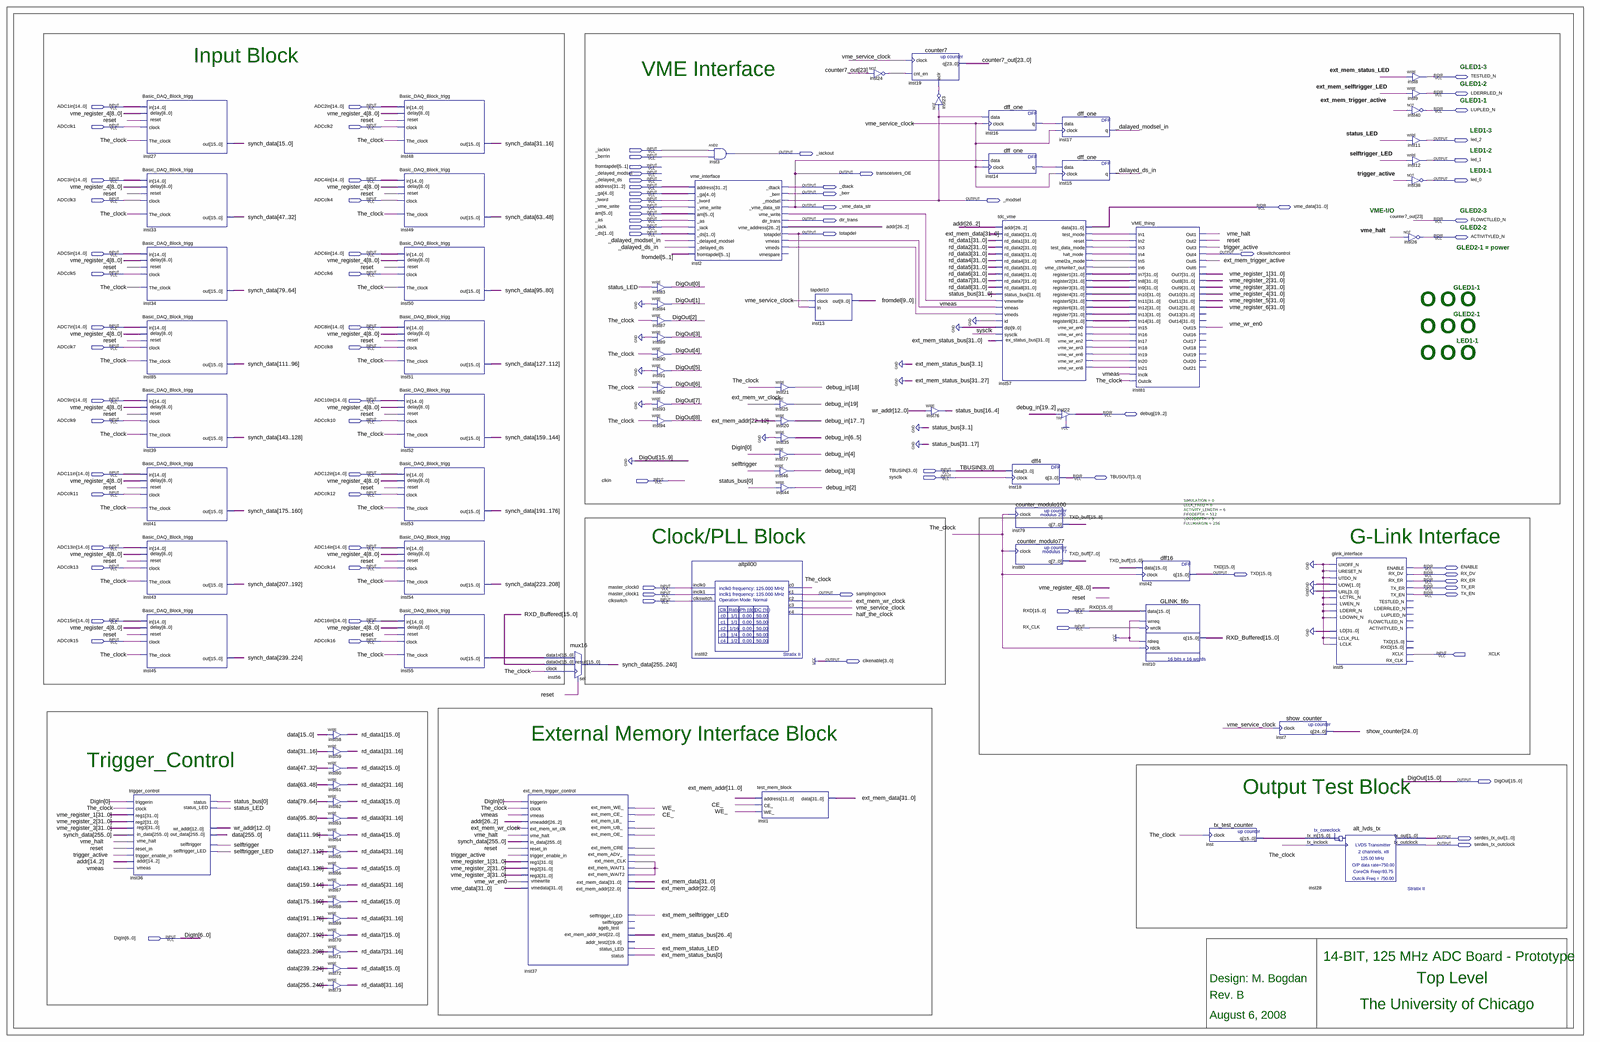
[diagram p0: schematic sheet, whole]
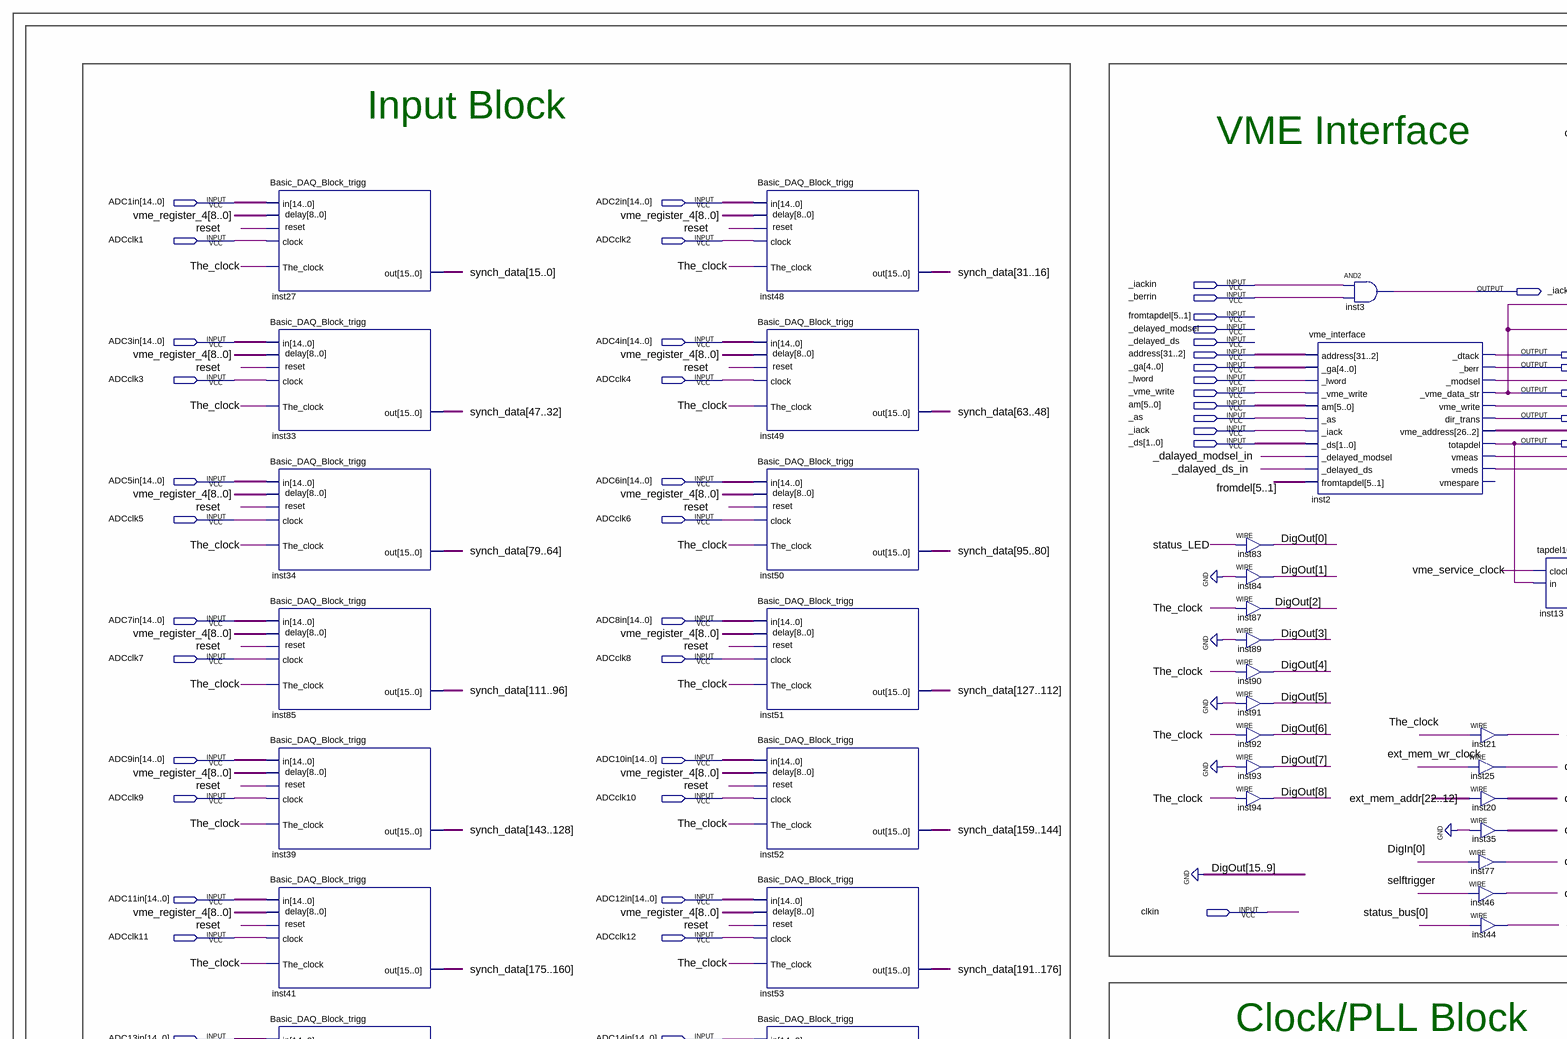
[diagram p1: schematic sheet, upper left part]
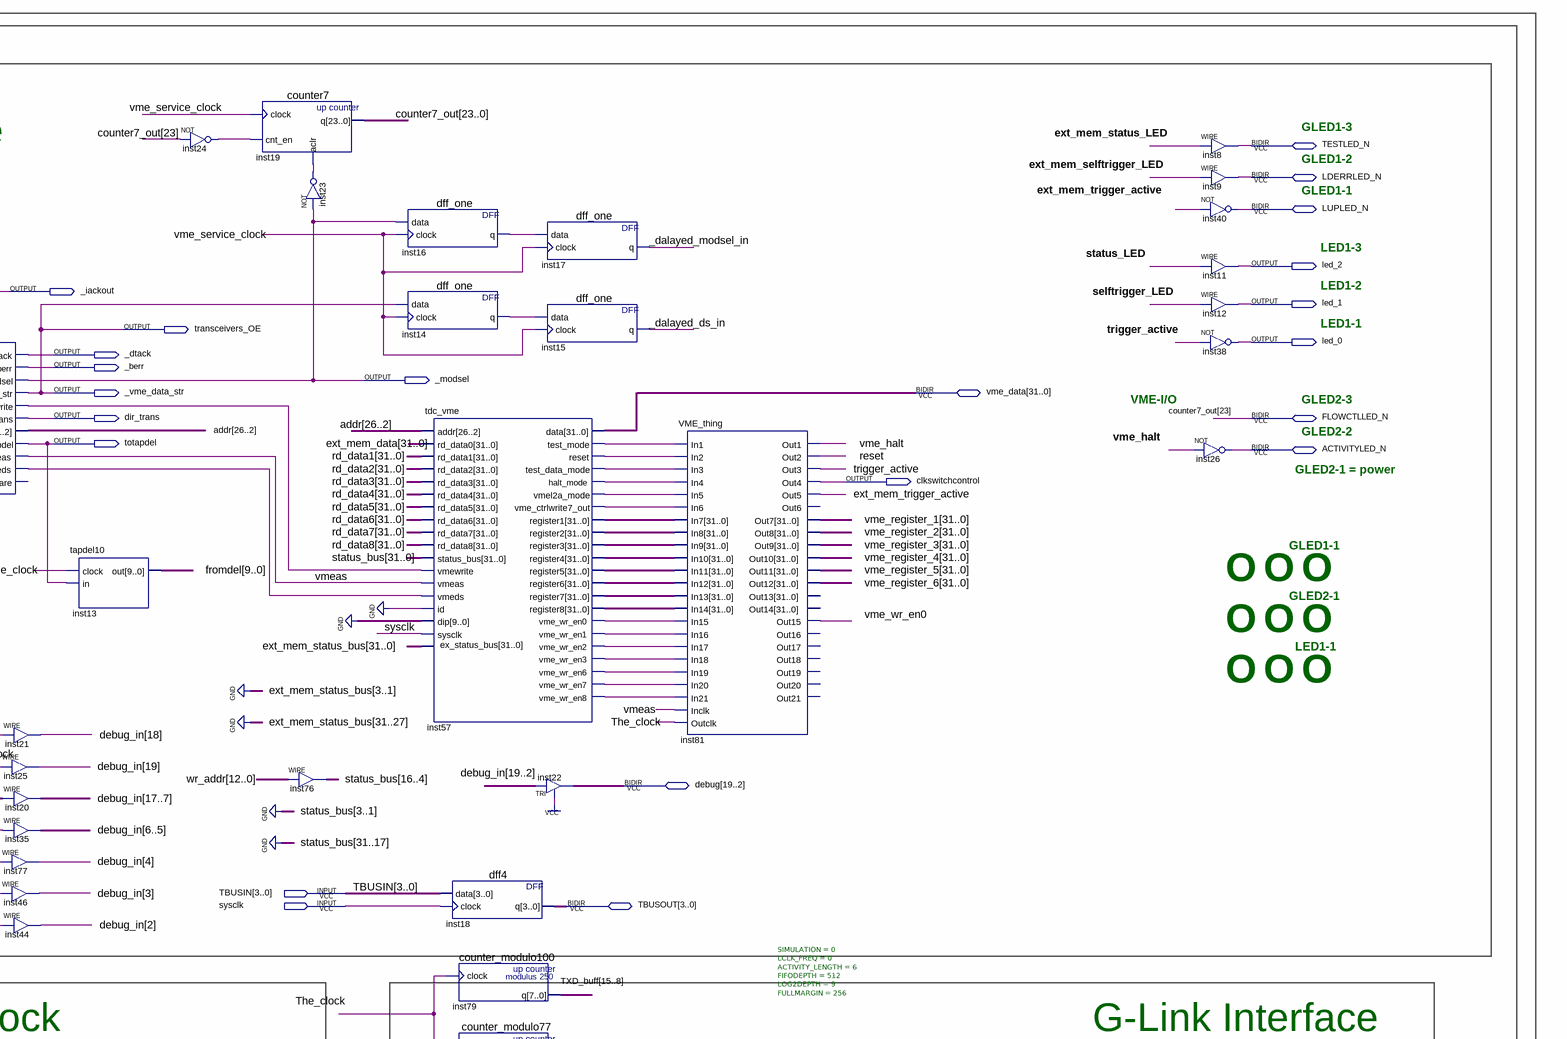
[diagram p2: schematic sheet, upper right part]
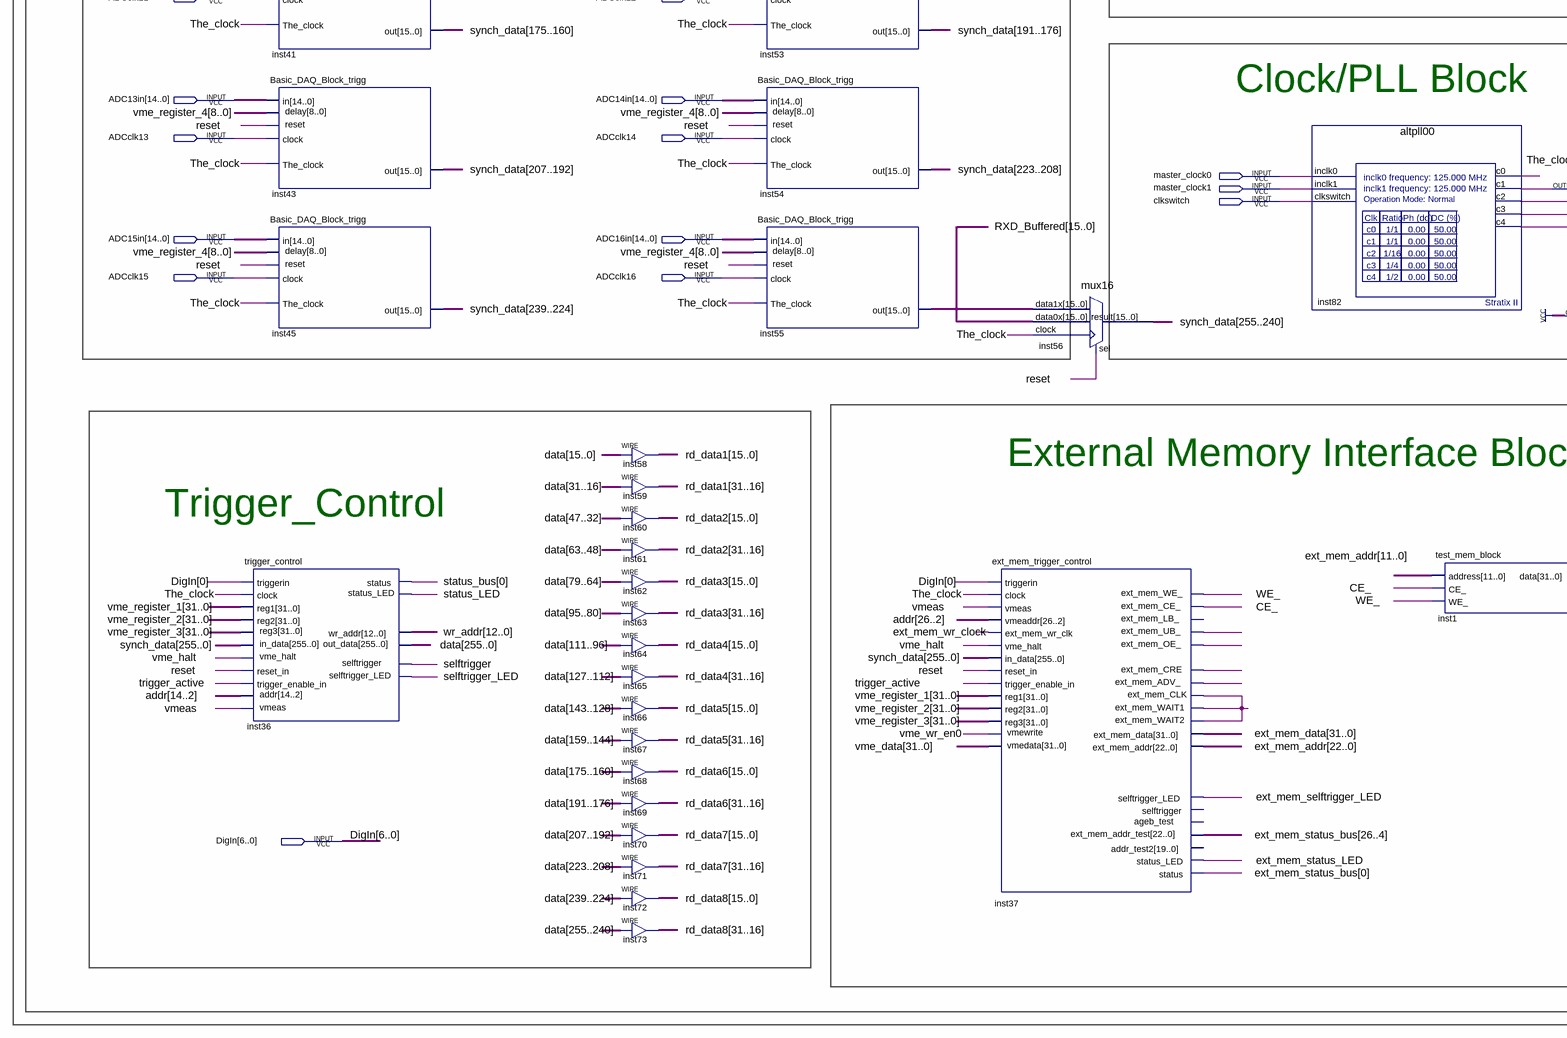
[diagram p3: schematic sheet, lower left part]
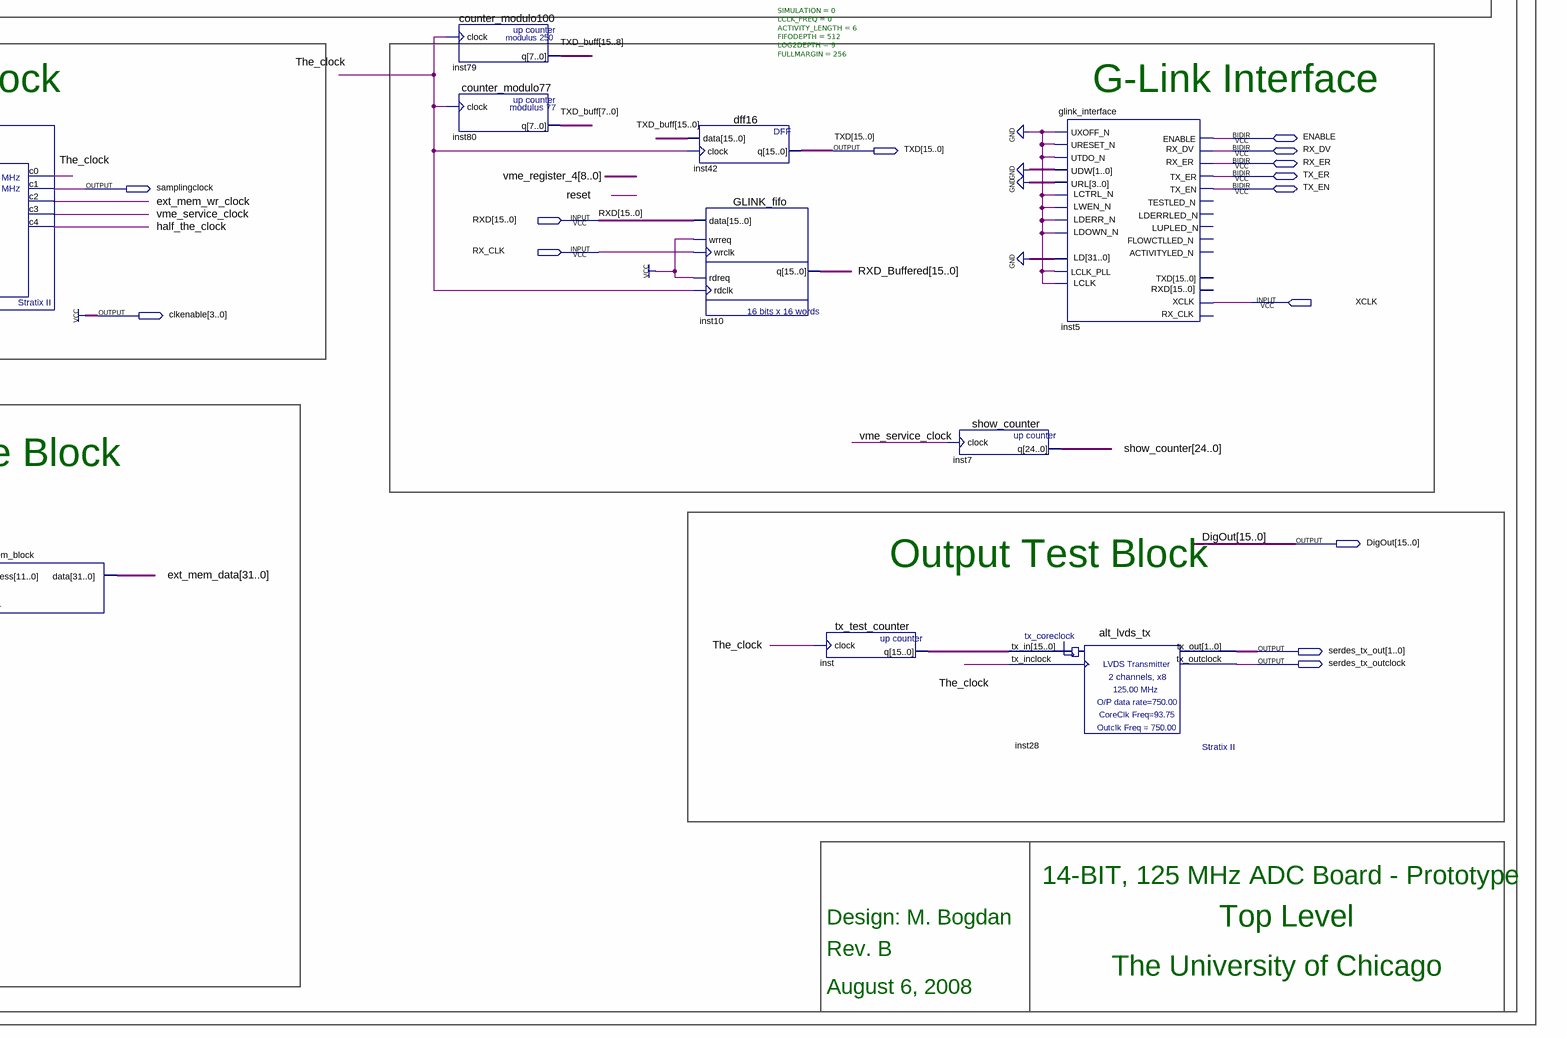
[diagram p4: schematic sheet, lower right part]
// Quartus schematic sigma_delta_old.bdf as structural Verilog: 83 symbols, 86 pins
module sigma_delta_old (
  input  [14:0] ADC1in,
  input  [14:0] ADC2in,
  input  ADCclk1,
  input  ADCclk2,
  input  _iackin,
  input  _berrin,
  input  [5:1] fromtapdel,
  input  _delayed_modsel,
  input  [14:0] ADC3in,
  input  [14:0] ADC4in,
  input  _delayed_ds,
  input  [31:2] address,
  input  [4:0] _ga,
  input  ADCclk3,
  input  ADCclk4,
  input  _lword,
  input  _vme_write,
  input  [5:0] am,
  input  _as,
  input  _iack,
  input  [1:0] _ds,
  input  [14:0] ADC5in,
  input  [14:0] ADC6in,
  input  ADCclk5,
  input  ADCclk6,
  input  [14:0] ADC7in,
  input  [14:0] ADC8in,
  input  ADCclk7,
  input  ADCclk8,
  input  [14:0] ADC9in,
  input  [14:0] ADC10in,
  input  ADCclk9,
  input  ADCclk10,
  input  [3:0] TBUSIN,
  input  [14:0] ADC11in,
  input  [14:0] ADC12in,
  input  sysclk,
  input  clkin,
  input  ADCclk11,
  input  ADCclk12,
  input  [14:0] ADC13in,
  input  [14:0] ADC14in,
  input  ADCclk13,
  input  ADCclk14,
  input  master_clock0,
  input  master_clock1,
  input  clkswitch,
  input  [15:0] RXD,
  input  [14:0] ADC15in,
  input  [14:0] ADC16in,
  input  RX_CLK,
  input  ADCclk15,
  input  ADCclk16,
  input  XCLK,
  input  [6:0] DigIn,
  inout  TESTLED_N,
  inout  LDERRLED_N,
  inout  LUPLED_N,
  inout  [31:0] vme_data,
  inout  FLOWCTLLED_N,
  inout  ACTIVITYLED_N,
  inout  [19:2] debug,
  inout  [3:0] TBUSOUT,
  inout  ENABLE,
  inout  RX_DV,
  inout  RX_ER,
  inout  TX_ER,
  inout  TX_EN,
  output led_2,
  output _iackout,
  output led_1,
  output transceivers_OE,
  output led_0,
  output _dtack,
  output _berr,
  output _modsel,
  output _vme_data_str,
  output dir_trans,
  output totapdel,
  output clkswitchcontrol,
  output [15:0] TXD,
  output samplingclock,
  output [3:0] clkenable,
  output [15:0] DigOut,
  output [1:0] serdes_tx_out,
  output serdes_tx_outclock
);

  wire _dalayed_ds_in, _dalayed_modsel_in, CE_, ext_mem_selftrigger_LED, ext_mem_status_LED,
       ext_mem_trigger_active, ext_mem_wr_clock, half_the_clock, inst2_vme_write, inst2_vmeds, inst5_lctrl_n,
       inst14_q, inst16_q, inst23_out, inst24_out, inst37_ext_mem_adv_, inst37_ext_mem_clk,
       inst37_ext_mem_cre, inst37_ext_mem_oe_, inst37_ext_mem_ub_, inst57_halt_mode, inst57_reset,
       inst57_test_data_mode, inst57_test_mode, inst57_vme_ctrlwrite7_out, inst57_vme_wr_en0,
       inst57_vme_wr_en1, inst57_vme_wr_en2, inst57_vme_wr_en3, inst57_vme_wr_en6, inst57_vme_wr_en7,
       inst57_vme_wr_en8, inst57_vmel2a_mode, reset, selftrigger, selftrigger_LED, status_LED, The_clock,
       trigger_active, vme_halt, vme_service_clock, vme_wr_en0, vmeas, WE_;
  wire [9:0] fromdel;
  wire [12:0] wr_addr;
  wire [15:0] inst55_out, inst_q, RXD_Buffered, TXD_buff;
  wire [16:0] status_bus;
  wire [19:2] debug_in;
  wire [22:0] counter7_out, ext_mem_addr;
  wire [24:0] show_counter;
  wire [26:0] ext_mem_status_bus;
  wire [26:2] addr;
  wire [31:0] ext_mem_data, inst5_ld, inst57_register1, inst57_register2, inst57_register3, inst57_register4,
       inst57_register5, inst57_register6, inst57_register7, inst57_register8, rd_data1, rd_data2, rd_data3,
       rd_data4, rd_data5, rd_data6, rd_data7, rd_data8, vme_register_1, vme_register_2, vme_register_3,
       vme_register_4, vme_register_5, vme_register_6;
  wire [255:0] data, synch_data;

  Basic_DAQ_Block_trigg inst27 (
    .in(ADC1in), .clock(ADCclk1), .The_clock(The_clock), .reset(reset), .delay(vme_register_4[8:0]),
    .out(synch_data[15:0]));
  Basic_DAQ_Block_trigg inst33 (
    .in(ADC3in), .clock(ADCclk3), .The_clock(The_clock), .reset(reset), .delay(vme_register_4[8:0]),
    .out(synch_data[47:32]));
  Basic_DAQ_Block_trigg inst34 (
    .in(ADC5in), .clock(ADCclk5), .The_clock(The_clock), .reset(reset), .delay(vme_register_4[8:0]),
    .out(synch_data[79:64]));
  Basic_DAQ_Block_trigg inst85 (
    .in(ADC7in), .clock(ADCclk7), .The_clock(The_clock), .reset(reset), .delay(vme_register_4[8:0]),
    .out(synch_data[111:96]));
  Basic_DAQ_Block_trigg inst39 (
    .in(ADC9in), .clock(ADCclk9), .The_clock(The_clock), .reset(reset), .delay(vme_register_4[8:0]),
    .out(synch_data[143:128]));
  Basic_DAQ_Block_trigg inst41 (
    .in(ADC11in), .clock(ADCclk11), .The_clock(The_clock), .reset(reset), .delay(vme_register_4[8:0]),
    .out(synch_data[175:160]));
  Basic_DAQ_Block_trigg inst43 (
    .in(ADC13in), .clock(ADCclk13), .The_clock(The_clock), .reset(reset), .delay(vme_register_4[8:0]),
    .out(synch_data[207:192]));
  Basic_DAQ_Block_trigg inst45 (
    .in(ADC15in), .clock(ADCclk15), .The_clock(The_clock), .reset(reset), .delay(vme_register_4[8:0]),
    .out(synch_data[239:224]));
  trigger_control inst36 (
    .clock(The_clock), .reg1(vme_register_1), .reg2(vme_register_2), .reg3(vme_register_3), .reset_in(reset),
    .trigger_enable_in(trigger_active), .vme_halt(vme_halt), .in_data(synch_data), .addr(addr[14:2]),
    .vmeas(vmeas), .triggerin(DigIn[0]), .status(status_bus[0]), .selftrigger(selftrigger),
    .selftrigger_LED(selftrigger_LED), .status_LED(status_LED), .wr_addr(wr_addr), .out_data(data));
  assign rd_data1[15:0] = data[15:0];  // WIRE inst58
  assign rd_data1[31:16] = data[31:16];  // WIRE inst59
  assign rd_data2[15:0] = data[47:32];  // WIRE inst60
  assign rd_data2[31:16] = data[63:48];  // WIRE inst61
  assign rd_data3[15:0] = data[79:64];  // WIRE inst62
  assign rd_data3[31:16] = data[95:80];  // WIRE inst63
  assign rd_data4[15:0] = data[111:96];  // WIRE inst64
  assign rd_data4[31:16] = data[127:112];  // WIRE inst65
  assign rd_data5[15:0] = data[143:128];  // WIRE inst66
  assign rd_data5[31:16] = data[159:144];  // WIRE inst67
  assign rd_data6[15:0] = data[175:160];  // WIRE inst68
  assign rd_data6[31:16] = data[191:176];  // WIRE inst69
  assign rd_data7[15:0] = data[207:192];  // WIRE inst70
  assign rd_data7[31:16] = data[223:208];  // WIRE inst71
  assign rd_data8[15:0] = data[239:224];  // WIRE inst72
  assign rd_data8[31:16] = data[255:240];  // WIRE inst73
  Basic_DAQ_Block_trigg inst48 (
    .in(ADC2in), .clock(ADCclk2), .The_clock(The_clock), .reset(reset), .delay(vme_register_4[8:0]),
    .out(synch_data[31:16]));
  Basic_DAQ_Block_trigg inst49 (
    .in(ADC4in), .clock(ADCclk4), .The_clock(The_clock), .reset(reset), .delay(vme_register_4[8:0]),
    .out(synch_data[63:48]));
  Basic_DAQ_Block_trigg inst50 (
    .in(ADC6in), .clock(ADCclk6), .The_clock(The_clock), .reset(reset), .delay(vme_register_4[8:0]),
    .out(synch_data[95:80]));
  Basic_DAQ_Block_trigg inst51 (
    .in(ADC8in), .clock(ADCclk8), .The_clock(The_clock), .reset(reset), .delay(vme_register_4[8:0]),
    .out(synch_data[127:112]));
  Basic_DAQ_Block_trigg inst52 (
    .in(ADC10in), .clock(ADCclk10), .The_clock(The_clock), .reset(reset), .delay(vme_register_4[8:0]),
    .out(synch_data[159:144]));
  Basic_DAQ_Block_trigg inst53 (
    .in(ADC12in), .clock(ADCclk12), .The_clock(The_clock), .reset(reset), .delay(vme_register_4[8:0]),
    .out(synch_data[191:176]));
  Basic_DAQ_Block_trigg inst54 (
    .in(ADC14in), .clock(ADCclk14), .The_clock(The_clock), .reset(reset), .delay(vme_register_4[8:0]),
    .out(synch_data[223:208]));
  Basic_DAQ_Block_trigg inst55 (
    .in(ADC16in), .clock(ADCclk16), .The_clock(The_clock), .reset(reset), .delay(vme_register_4[8:0]),
    .out(inst55_out));
  mux16 inst56 (
    .data1x(inst55_out), .data0x(RXD_Buffered), .clock(The_clock), .sel(reset), .result(synch_data[255:240]));
  ext_mem_trigger_control inst37 (
    .clock(The_clock), .vmeas(vmeas), .ext_mem_wr_clk(ext_mem_wr_clock), .vme_halt(vme_halt),
    .in_data(synch_data), .reset_in(reset), .trigger_enable_in(trigger_active), .reg1(vme_register_1),
    .reg2(vme_register_2), .reg3(vme_register_3), .vmewrite(vme_wr_en0), .vmedata(vme_data), .vmeaddr(addr),
    .triggerin(DigIn[0]), .selftrigger_LED(ext_mem_selftrigger_LED), .ext_mem_addr(ext_mem_addr),
    .status(ext_mem_status_bus[0]), .status_LED(ext_mem_status_LED), .ext_mem_WE_(WE_), .ext_mem_CE_(CE_),
    .ext_mem_UB_(inst37_ext_mem_ub_), .ext_mem_OE_(inst37_ext_mem_oe_), .ext_mem_CRE(inst37_ext_mem_cre),
    .ext_mem_ADV_(inst37_ext_mem_adv_), .ext_mem_CLK(inst37_ext_mem_clk), .ext_mem_WAIT1(inst37_ext_mem_clk),
    .ext_mem_addr_test(ext_mem_status_bus[26:4]), .ext_mem_data(ext_mem_data),
    .ext_mem_WAIT2(inst37_ext_mem_clk));  // open: selftrigger, addr_test2, ext_mem_LB_, ageb_test
  assign DigOut[0] = status_LED;  // WIRE inst83
  assign DigOut[1] = 1'b0;  // WIRE inst84
  assign DigOut[2] = The_clock;  // WIRE inst87
  assign DigOut[3] = 1'b0;  // WIRE inst89
  assign DigOut[4] = The_clock;  // WIRE inst90
  assign DigOut[5] = 1'b0;  // WIRE inst91
  assign DigOut[6] = The_clock;  // WIRE inst92
  assign DigOut[7] = 1'b0;  // WIRE inst93
  assign DigOut[8] = The_clock;  // WIRE inst94
  vme_interface inst2 (
    .address(address), ._ga(_ga), ._lword(_lword), ._vme_write(_vme_write), .am(am), ._as(_as),
    ._iack(_iack), ._ds(_ds), ._delayed_modsel(_dalayed_modsel_in), ._delayed_ds(_dalayed_ds_in),
    .fromtapdel(fromdel[5:1]), ._modsel(_modsel), ._vme_data_str(_vme_data_str), .vme_write(inst2_vme_write),
    .dir_trans(dir_trans), .vme_address(addr), .totapdel(totapdel), .vmeas(vmeas), .vmeds(inst2_vmeds),
    ._dtack(_dtack), ._berr(_berr));  // open: vmespare
  altpll00 inst82 (
    .inclk0(master_clock0), .inclk1(master_clock1), .clkswitch(clkswitch), .c0(The_clock),
    .c1(samplingclock), .c2(ext_mem_wr_clock), .c3(vme_service_clock), .c4(half_the_clock));
  and inst3 (_iackout, _iackin, _berrin);
  test_mem_block inst1 (.CE_(CE_), .WE_(WE_), .address(ext_mem_addr[11:0]), .data(ext_mem_data));
  assign debug_in[18] = The_clock;  // WIRE inst21
  assign debug_in[19] = ext_mem_wr_clock;  // WIRE inst25
  assign debug_in[17:7] = ext_mem_addr[22:12];  // WIRE inst20
  assign debug_in[6:5] = 2'b00;  // WIRE inst35
  assign debug_in[4] = DigIn[0];  // WIRE inst77
  assign debug_in[3] = selftrigger;  // WIRE inst46
  assign debug_in[2] = status_bus[0];  // WIRE inst44
  tapdel10 inst13 (.clock(vme_service_clock), .in(totapdel), .out(fromdel));
  not inst24 (inst24_out, FLOWCTLLED_N);
  counter7 inst19 (.clock(vme_service_clock), .cnt_en(inst24_out), .aclr(inst23_out), .q({FLOWCTLLED_N, counter7_out}));
  not inst23 (inst23_out, _modsel);
  assign status_bus[16:4] = wr_addr;  // WIRE inst76
  dff_one inst16 (.data(_modsel), .clock(vme_service_clock), .q(inst16_q));
  dff_one inst14 (.data(_vme_data_str), .clock(vme_service_clock), .q(inst14_q));
  tdc_vme inst57 (
    .addr(addr), .rd_data0(ext_mem_data), .rd_data1(rd_data1), .rd_data2(rd_data2), .rd_data3(rd_data3),
    .rd_data4(rd_data4), .rd_data5(rd_data5), .rd_data6(rd_data6), .rd_data7(rd_data7), .rd_data8(rd_data8),
    .status_bus({{15{1'b0}}, status_bus[16:4], 3'b000, status_bus[0]}), .vmewrite(inst2_vme_write),
    .vmeas(vmeas), .vmeds(inst2_vmeds), .id(1'b0), .dip({10{1'b0}}), .sysclk(sysclk),
    .ex_status_bus({{5{1'b0}}, ext_mem_status_bus[26:4], 3'b000, ext_mem_status_bus[0]}),
    .test_mode(inst57_test_mode), .reset(inst57_reset), .test_data_mode(inst57_test_data_mode),
    .halt_mode(inst57_halt_mode), .vmel2a_mode(inst57_vmel2a_mode),
    .vme_ctrlwrite7_out(inst57_vme_ctrlwrite7_out), .register1(inst57_register1),
    .register2(inst57_register2), .register3(inst57_register3), .register4(inst57_register4),
    .register5(inst57_register5), .register6(inst57_register6), .register7(inst57_register7),
    .register8(inst57_register8), .vme_wr_en0(inst57_vme_wr_en0), .vme_wr_en1(inst57_vme_wr_en1),
    .vme_wr_en2(inst57_vme_wr_en2), .vme_wr_en3(inst57_vme_wr_en3), .vme_wr_en6(inst57_vme_wr_en6),
    .vme_wr_en7(inst57_vme_wr_en7), .vme_wr_en8(inst57_vme_wr_en8), .data(vme_data));
  dff4 inst18 (.data(TBUSIN), .clock(sysclk), .q(TBUSOUT));
  counter_modulo100 inst79 (.clock(The_clock), .q(TXD_buff[15:8]));
  counter_modulo77 inst80 (.clock(The_clock), .q(TXD_buff[7:0]));
  dff_one inst17 (.data(inst16_q), .clock(vme_service_clock), .q(_dalayed_modsel_in));
  dff_one inst15 (.data(inst14_q), .clock(vme_service_clock), .q(_dalayed_ds_in));
  TRI inst22[17:0] (.IN(debug_in), .OE(1'b1), .OUT(debug));
  VME_thing inst81 (
    .In1(inst57_test_mode), .In2(inst57_reset), .In3(inst57_test_data_mode), .In4(inst57_halt_mode),
    .In5(inst57_vmel2a_mode), .In6(inst57_vme_ctrlwrite7_out), .In7(inst57_register1),
    .In8(inst57_register2), .In9(inst57_register3), .In10(inst57_register4), .In11(inst57_register5),
    .In12(inst57_register6), .In13(inst57_register7), .In14(inst57_register8), .In15(inst57_vme_wr_en0),
    .In16(inst57_vme_wr_en1), .In17(inst57_vme_wr_en2), .In18(inst57_vme_wr_en3), .In19(inst57_vme_wr_en6),
    .In20(inst57_vme_wr_en7), .In21(inst57_vme_wr_en8), .Inclk(vmeas), .Outclk(The_clock), .Out1(vme_halt),
    .Out2(reset), .Out3(trigger_active), .Out4(clkswitchcontrol), .Out5(ext_mem_trigger_active),
    .Out7(vme_register_1), .Out8(vme_register_2), .Out9(vme_register_3), .Out10(vme_register_4),
    .Out11(vme_register_5), .Out12(vme_register_6), .Out15(vme_wr_en0));  // open: Out6, Out13, Out14, Out16, Out17, Out18, Out19, Out20, Out21
  dff16 inst42 (.data(TXD_buff), .clock(The_clock), .q(TXD));
  GLINK_fifo inst10 (.data(RXD), .wrreq(1'b1), .wrclk(RX_CLK), .rdreq(1'b1), .rdclk(The_clock), .q(RXD_Buffered));
  tx_test_counter inst (.clock(The_clock), .q(inst_q));
  show_counter inst7 (.clock(vme_service_clock), .q(show_counter));
  alt_lvds_tx inst28 (.tx_in(inst_q), .tx_inclock(The_clock), .tx_outclock(serdes_tx_outclock), .tx_out(serdes_tx_out));
  glink_interface #(.SIMULATION(0), .LCLK_FREQ(0), .ACTIVITY_LENGTH(6), .FIFODEPTH(512), .LOG2DEPTH(9), .FULLMARGIN(256)) inst5 (
    .UXOFF_N(inst5_lctrl_n), .URESET_N(inst5_lctrl_n), .UTDO_N(inst5_lctrl_n), .UDW(2'b00), .URL(4'b0000),
    .XCLK(XCLK), .RX_ER(RX_ER), .RX_DV(RX_DV), .LCLK_PLL(inst5_lctrl_n), .LD(inst5_ld),
    .LCTRL_N(inst5_lctrl_n), .LWEN_N(inst5_lctrl_n), .LCLK(inst5_lctrl_n), .LDERR_N(inst5_lctrl_n),
    .LDOWN_N(inst5_lctrl_n), .ENABLE(ENABLE), .TX_EN(TX_EN), .TX_ER(TX_ER));  // open: RXD, RX_CLK, TESTLED_N, LDERRLED_N, LUPLED_N, FLOWCTLLED_N, ACTIVITYLED_N, TXD
  assign TESTLED_N = ext_mem_status_LED;  // WIRE inst8
  assign LDERRLED_N = ext_mem_selftrigger_LED;  // WIRE inst9
  not inst40 (LUPLED_N, ext_mem_trigger_active);
  assign led_2 = status_LED;  // WIRE inst11
  assign led_1 = selftrigger_LED;  // WIRE inst12
  not inst38 (led_0, trigger_active);
  not inst26 (ACTIVITYLED_N, vme_halt);

  assign clkenable = 4'b1111;
  assign DigOut[15:9] = {7{1'b0}};
  assign transceivers_OE = _vme_data_str;
  // also tied to GND on the sheet: {inst5_lctrl_n, inst5_ld[0], inst5_ld[1], inst5_ld[2], inst5_ld[3], inst5_ld[4], inst5_ld[5], inst5_ld[6], inst5_ld[7], inst5_ld[8], inst5_ld[9], inst5_ld[10], inst5_ld[11], inst5_ld[12], inst5_ld[13], inst5_ld[14], inst5_ld[15], inst5_ld[16], inst5_ld[17], inst5_ld[18], inst5_ld[19], inst5_ld[20], inst5_ld[21], inst5_ld[22], inst5_ld[23], inst5_ld[24], inst5_ld[25], inst5_ld[26], inst5_ld[27], inst5_ld[28], inst5_ld[29], inst5_ld[30], inst5_ld[31]}

  // Other names for the same wires on the sheet: counter7_out[23] = FLOWCTLLED_N

  // Notes on the sheet:
  //   Input Block
  //   VME Interface
  //   GLED1-3
  //   GLED1-2
  //   GLED1-1
  //   LED1-3
  //   LED1-2
  //   LED1-1
  //   VME-I/O
  //   GLED2-3
  //   GLED2-2
  //   GLED2-1 = power
  //   GLED1-1
  //   O
  //   O
  //   O
  //   GLED2-1
  //   O
  //   O
  //   O
  //   LED1-1
  //   O
  //   O
  //   O
  //   Clock/PLL Block
  //   G-Link Interface
  //   External Memory Interface Block
  //   Trigger_Control
  //   Output Test Block
  //   14-BIT, 125 MHz ADC Board - Prototype
  //   Top Level
  //   Design: M. Bogdan
  //   Rev. B
  //   The University of Chicago
  //   August 6, 2008
endmodule
